# Altium project EXTERN.PrjPcb
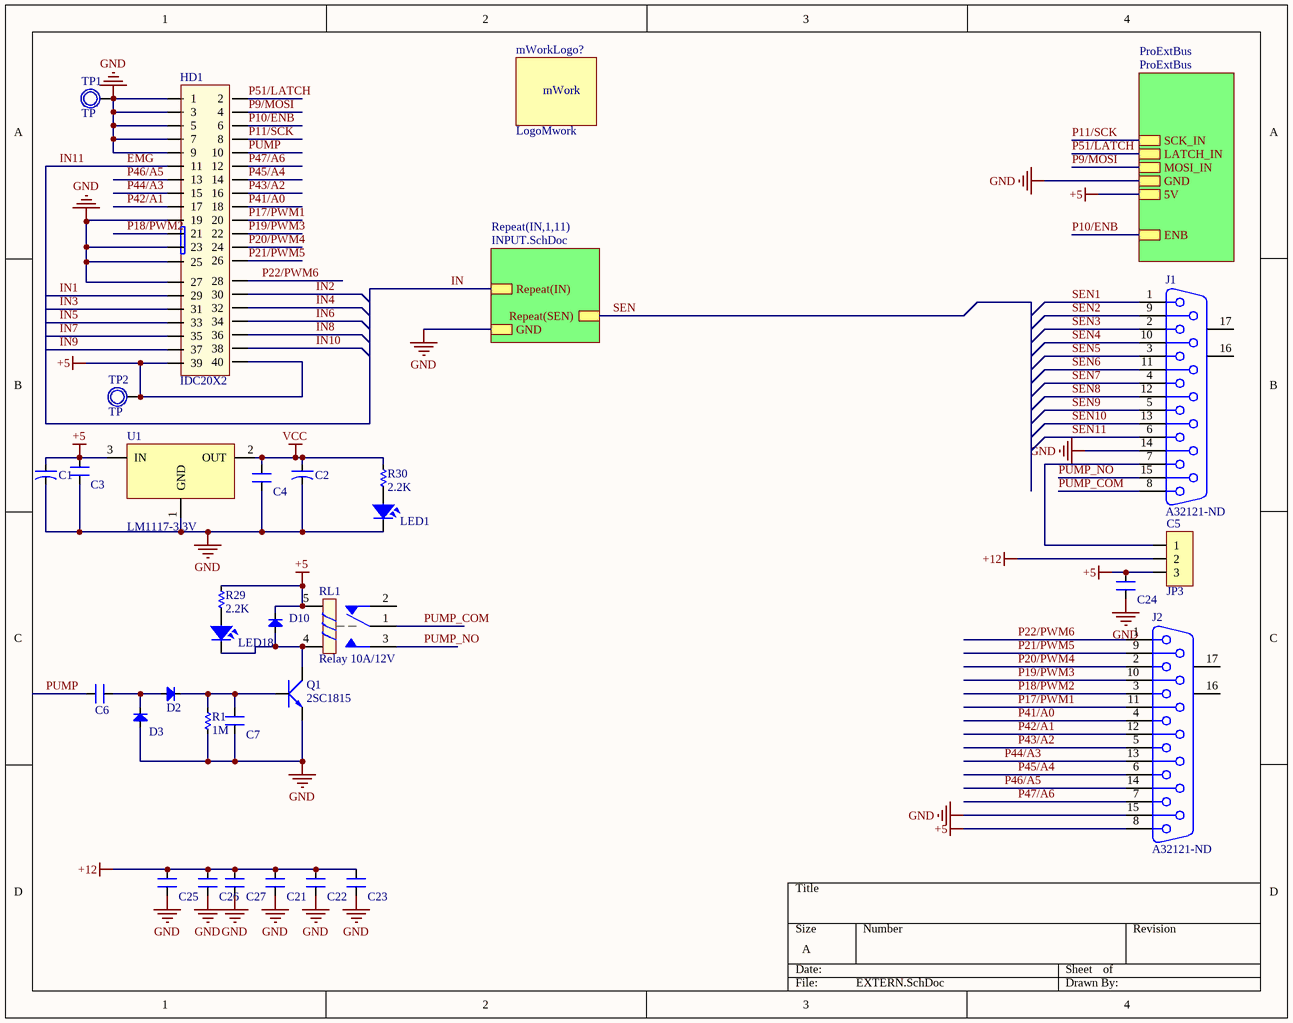
[diagram p0: EXTERN.SchDoc]
3 sheets, 156 parts. Net scope: hierarchical (ports join the sheet entries above them; power ports are global).
Board file: Exter.PcbDoc
Sheets:
  EXTERN.SchDoc
    ProExtBus = ProExtBus.SchDoc
    IN1 = INPUT.SchDoc
    IN2 = INPUT.SchDoc
    IN3 = INPUT.SchDoc
    IN4 = INPUT.SchDoc
    IN5 = INPUT.SchDoc
    IN6 = INPUT.SchDoc
    IN7 = INPUT.SchDoc
    IN8 = INPUT.SchDoc
    IN9 = INPUT.SchDoc
    IN10 = INPUT.SchDoc
    IN11 = INPUT.SchDoc

## Sheet EXTERN.SchDoc
size A

### Parts
(Parts that share a designator on the sheet are numbered #1, #2 ... from top to bottom, then left to right.)
C1  CN-ALU-SMD  [CAP-ALU-SMD-F]  (value not drawn)
C2  CN-ALU-SMD  [CAP-ALU-SMD-F]  (value not drawn)
C3  CN  [CN-SMD-0603_big]  (value not drawn)
C4  CN  [CN-SMD-0603_big]  (value not drawn)
C5  JP3  [JP3-CLOSED]
C6  10nF  [CN-SMD-0805]  (value not drawn)
C7  10nF  [CN-SMD-0805]  (value not drawn)
C21  CN  [CN-SMD-0603_big]  (value not drawn)
C22  CN  [CN-SMD-0603_big]  (value not drawn)
C23  CN  [CN-SMD-0603_big]  (value not drawn)
C24  CN  [CN-SMD-0603_big]  (value not drawn)
C25  CN  [CN-SMD-0603_big]  (value not drawn)
C26  CN  [CN-SMD-0603_big]  (value not drawn)
C27  CN  [CN-SMD-0603_big]  (value not drawn)
D2#1  Diode  [DIO-SMD-106-HayDung]  (value not drawn)
D3  Diode  [DIO-SMD-106-HayDung]  (value not drawn)
D10  1N4148  [DIO-SMD-106-HayDung]  (value not drawn)
HD1  IDC20X2  [IDC40]
J1  A32121-ND  [DB15]
J2  A32121-ND  [DB15]
LED1  LED  [LED-0805-Blue]  (value not drawn)
LED18  LED  [LED-0805-Blue]  (value not drawn)
mWorkLogo?  LogoMwork  [LogoMwork30*12]
Q1  2SC1815  [TO92-123]
R1  1M  [RES-SMD-0805]
R29  2.2K  [RES-SMD-0805]
R30  2.2K  [RES-SMD-0805]
RL1  Relay 10A/12V  [RELAY 5]
TP1  TP  [TP1]
TP2  TP  [TP1]
U1  LM1117-3.3V  [SOT223]

### Sub-sheets
ProExtBus = ProExtBus: SCK_IN, LATCH_IN, MOSI_IN, GND, 5V, ENB
Repeat(IN,1,11) = INPUT.SchDoc: Repeat(IN), GND, Repeat(SEN)

### Nets
+5: C1.1 C2.1 C3.2 C4.2 C5.3 C24.2 D10.2(K) HD1.39 HD1.40 J2.8 R29.1 R30.1 RL1.5 TP2.1 U1.2(OUT) U1.3(IN) ; sheet ProExtBus/5V  [also labelled VCC]
+12: C5.2 C21.2 C22.2 C23.2 C25.2 C26.2 C27.2
GND: C1.2 C2.2 C3.1 C4.1 C7.1 C21.1 C22.1 C23.1 C24.1 C25.1 C26.1 C27.1 D3.1(A) HD1.1 HD1.3 HD1.5 HD1.7 HD1.9 HD1.19 HD1.23 HD1.25 HD1.27 J1.14 J2.15 LED1.2 Q1.1(E) R1.2 TP1.1 U1.1(GND) ; sheet ProExtBus/GND, sheet Repeat(IN,1,11)/GND
EMG: HD1.11  [also labelled IN11]
IN: sheet Repeat(IN,1,11)/Repeat(IN)
IN1: HD1.29
IN2: HD1.30
IN3: HD1.31
IN4: HD1.32
IN5: HD1.33
IN6: HD1.34
IN7: HD1.35
IN8: HD1.36
IN9: HD1.37
IN10: HD1.38
P9/MOSI: HD1.4 ; sheet ProExtBus/MOSI_IN
P10/ENB: HD1.6 ; sheet ProExtBus/ENB
P11/SCK: HD1.8 ; sheet ProExtBus/SCK_IN
P17/PWM1: HD1.20 J2.11
P18/PWM2: HD1.21 J2.3
P19/PWM3: HD1.22 J2.10
P20/PWM4: HD1.24 J2.2
P21/PWM5: HD1.26 J2.9
P22/PWM6: HD1.28 J2.1
P41/A0: HD1.18 J2.4
P42/A1: HD1.17 J2.12
P43/A2: HD1.16 J2.5
P44/A3: HD1.15 J2.13
P45/A4: HD1.14 J2.6
P46/A5: HD1.13 J2.14
P47/A6: HD1.12 J2.7
P51/LATCH: HD1.2 ; sheet ProExtBus/LATCH_IN
PUMP: C6.1 HD1.10
PUMP_COM: J1.8 RL1.1
PUMP_NO: J1.15 RL1.3
SEN: sheet Repeat(IN,1,11)/Repeat(SEN)
SEN1: J1.1
SEN2: J1.9
SEN3: J1.2
SEN4: J1.10
SEN5: J1.3
SEN6: J1.11
SEN7: J1.4
SEN8: J1.12
SEN9: J1.5
SEN10: J1.13
SEN11: J1.6
NetC5_1: C5.1 J1.7
NetC6_2: C6.2 D2#1.1(A) D3.2(K)
NetC7_2: C7.2 D2#1.2(K) Q1.3(B) R1.1
NetD10_1: D10.1(A) LED18.2 Q1.2(C) RL1.4
NetLED1_1: LED1.1 R30.2
NetLED18_1: LED18.1 R29.2

Not connected (* = marked no-connect by the designer): J1 16(MH1) 17(MH2); J2 16(MH1) 17(MH2); RL1 2

### Notes on the sheet
- (in symbol LogoMwork) mWork

### Library data of the parts
C1 C2 = CN-ALU-SMD: Polarized Capacitor (Axial); Published: 8-Jun-2000; LatestRevisionDate: 17-Jul-2002; LatestRevisionNote: Re-released for DXP Platform.; PackageReference: POLAR0.8; Publisher: Altium Limited
C3 C4 C6 C7 C21-C27 = CN: Value: 33pF
C5 = JP3: WR-PHD 2.54 mm Angled Socket Header; Manufacturer: W¨¹rth Elektronik eiSos GmbH; partNo: 613003143121; ComponentLink1 Description: Manufacturer; ComponentLink2 Description: Datasheet; NoPins: 03; Created Date: 29 March 2013; ComponentLink1URL: http://www.we-online.com; ComponentLink2URL: http://katalog.we-online.de/em/datasheet/6130xx143121.pdf; Created by: Karrer Zheng
D2#1 D3 D10 = Diode: Default Diode; Code - JEDEC: DO-214-AB; Value: 1N5007; Published: 8-Jun-2000; Revision: July-2002: Re-released for DXP Platform.; Publisher: Altium Limited; ComponentLink1Description: ES1J - STMBL; ComponentLink1URL: https://banlinhkien.vn/goods-8089-es1j-do214-diode-1a-600v-sma-es1j-.html
HD1 = IDC20X2: IDC 13x2; Value: Header 5x2
J1 J2 = DB15: Receptacle Assembly, 15 Position, Right Angle; PackageDocument: O; Positions: 15; Published: 15-Jun-2001; LatestRevisionDate: 17-Jul-2002; LatestRevisionNote: Re-released for DXP Platform.; DatasheetDocument: 1-Sep-99; PackageReference: 788757; Publisher: Altium Limited; Orientation: Right Angle; Gender: Receptacle
LED1 LED18 = LED SMD: Value: LED 3 - 5 ly 2 Colour
Q1 = 2SC1815: NPN 600mW, ECB; Value: C1815
R1 R29 R30 = R
RL1 = Relay 5: Relay SPDT,10A - 12VDC 5 Pin; Value: Relay SPDT, 10A, 12V
TP1 TP2 = TP1: Test Point; Value: Test Point
U1 = LM1117: 800mA Low-Dropout Linear Regulator; Creator: Nguyen Ba Bien; Website: http://group3i.net

## Sheet ProExtBus.SchDoc
size A
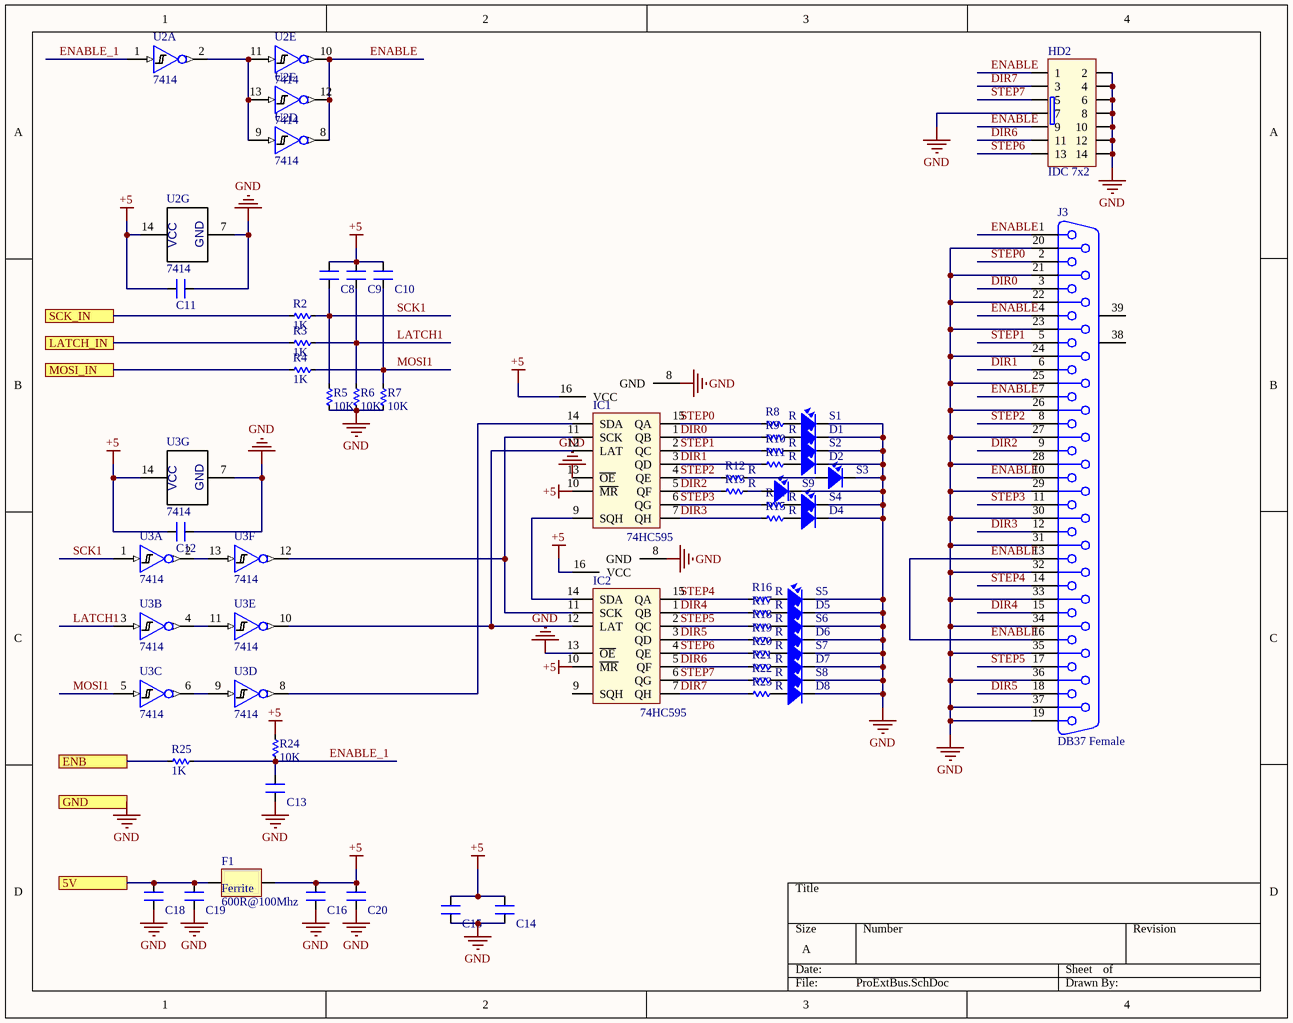
[diagram p1: ProExtBus.SchDoc]

### Parts
(Parts that share a designator on the sheet are numbered #1, #2 ... from top to bottom, then left to right.)
C8  CN  [CN-SMD-0603_big]  (value not drawn)
C9  CN  [CN-SMD-0603_big]  (value not drawn)
C10  CN  [CN-SMD-0603_big]  (value not drawn)
C11  CN  [CN-SMD-0603_big]  (value not drawn)
C12  CN  [CN-SMD-0603_big]  (value not drawn)
C13  CN  [CN-SMD-0603_big]  (value not drawn)
C14  CN  [CN-SMD-0603_big]  (value not drawn)
C15  CN  [CN-SMD-0603_big]  (value not drawn)
C16  CN  [CN-SMD-0603_big]  (value not drawn)
C18  CN  [CN-SMD-0603_big]  (value not drawn)
C19  CN  [CN-SMD-0603_big]  (value not drawn)
C20  CN  [CN-SMD-0603_big]  (value not drawn)
D1  LED  [LED-0805-Blue]  (value not drawn)
D2#2  LED  [LED-0805-Blue]  (value not drawn)
D4  LED  [LED-0805-Blue]  (value not drawn)
D5  LED  [LED-0805-Blue]  (value not drawn)
D6  LED  [LED-0805-Blue]  (value not drawn)
D7  LED  [LED-0805-Blue]  (value not drawn)
D8  LED  [LED-0805-Blue]  (value not drawn)
F1  600R@100Mhz  [Capacitor_805]
HD2  IDC 7x2  [IDC14]
IC1  74HC595  [SO16]
IC2  74HC595  [SO16]
J3  DB37 Female  [DB37]
R2  1K  [RES-SMD-0603_BIG]
R3  1K  [RES-SMD-0603_BIG]
R4  1K  [RES-SMD-0603_BIG]
R5  10K  [RES-SMD-0603_BIG]
R6  10K  [RES-SMD-0603_BIG]
R7  10K  [RES-SMD-0603_BIG]
R8  R  [RES-SMD-0603_BIG]
R9  R  [RES-SMD-0603_BIG]
R10  R  [RES-SMD-0603_BIG]
R11  R  [RES-SMD-0603_BIG]
R12  R  [RES-SMD-0603_BIG]
R13  R  [RES-SMD-0603_BIG]
R14  R  [RES-SMD-0603_BIG]
R15  R  [RES-SMD-0603_BIG]
R16  R  [RES-SMD-0603_BIG]
R17  R  [RES-SMD-0603_BIG]
R18  R  [RES-SMD-0603_BIG]
R19  R  [RES-SMD-0603_BIG]
R20  R  [RES-SMD-0603_BIG]
R21  R  [RES-SMD-0603_BIG]
R22  R  [RES-SMD-0603_BIG]
R23  R  [RES-SMD-0603_BIG]
R24  10K  [RES-SMD-0603_BIG]
R25  1K  [RES-SMD-0603_BIG]
S1  LED  [LED-0805-Blue]  (value not drawn)
S2  LED  [LED-0805-Blue]  (value not drawn)
S3  LED  [LED-0805-Blue]  (value not drawn)
S4  LED  [LED-0805-Blue]  (value not drawn)
S5  LED  [LED-0805-Blue]  (value not drawn)
S6  LED  [LED-0805-Blue]  (value not drawn)
S7  LED  [LED-0805-Blue]  (value not drawn)
S8  LED  [LED-0805-Blue]  (value not drawn)
S9  LED  [LED-0805-Blue]  (value not drawn)
U2  7414  [SO14]  (parts A,D,E,F,G of 7)
U3  7414  [SO14]  (parts A,B,C,D,E,F,G of 7)

### Ports
5V, ENB, GND, LATCH_IN, MOSI_IN, SCK_IN

### Nets
+5: C8.2 C9.2 C10.2 C11.1 C12.1 C14.2 C15.2 C16.2 C18.2 C19.2 C20.2 F1.1 F1.2 IC1.10(~{MR}) IC1.16(VCC) IC2.10(~{MR}) IC2.16(VCC) R24.1 U2.14(VCC) U3.14(VCC) ; port 5V  [also labelled VCC]
GND: C11.2 C12.2 C13.1 C14.1 C15.1 C16.1 C18.1 C19.1 C20.1 D1.2 D2#2.2 D4.2 D5.2 D6.2 D7.2 D8.2 HD2.2 HD2.4 HD2.6 HD2.7 HD2.8 HD2.10 HD2.12 HD2.14 IC1.8(GND) IC1.13(~{OE}) IC2.8(GND) IC2.13(~{OE}) J3.19 J3.20 J3.21 J3.22 J3.23 J3.24 J3.25 J3.26 J3.27 J3.28 J3.29 J3.30 J3.31 J3.32 J3.33 J3.34 J3.35 J3.36 J3.37 R5.2 R6.2 R7.2 S1.2 S2.2 S3.2 S4.2 S5.2 S6.2 S7.2 S8.2 S9.2 U2.7(GND) U3.7(GND) ; port GND
DIR0: IC1.1(QB) J3.3 R9.1
DIR1: IC1.3(QD) J3.6 R11.1
DIR2: IC1.5(QF) J3.9 R13.1
DIR3: IC1.7(QH) J3.12 R15.1
DIR4: IC2.1(QB) J3.15 R17.1
DIR5: IC2.3(QD) J3.18 R19.1
DIR6: HD2.11 IC2.5(QF) R21.1
DIR7: HD2.3 IC2.7(QH) R23.1
ENABLE: HD2.1 HD2.9 J3.1 J3.4 J3.7 J3.10 J3.13 J3.16 U2.8(Y) U2.10(Y) U2.12(Y)
ENABLE_1: C13.2 R24.2 R25.1 U2.1(A)
LATCH1: C9.1 R3.1 R6.1 U3.3(A)
MOSI1: C10.1 R4.1 R7.1 U3.5(A)
P9/MOSI: R4.2 ; port MOSI_IN
P10/ENB: R25.2 ; port ENB
P11/SCK: R2.2 ; port SCK_IN
P51/LATCH: R3.2 ; port LATCH_IN
SCK1: C8.1 R2.1 R5.1 U3.1(A)
STEP0: IC1.15(QA) J3.2 R8.1
STEP1: IC1.2(QC) J3.5 R10.1
STEP2: IC1.4(QE) J3.8 R12.1
STEP3: IC1.6(QG) J3.11 R14.1
STEP4: IC2.15(QA) J3.14 R16.1
STEP5: IC2.2(QC) J3.17 R18.1
STEP6: HD2.13 IC2.4(QE) R20.1
STEP7: HD2.5 IC2.6(QG) R22.1
NetD1_1: D1.1 R9.2
NetD2#2_1: D2#2.1 R11.2
NetD4_1: D4.1 R15.2
NetD5_1: D5.1 R17.2
NetD6_1: D6.1 R19.2
NetD7_1: D7.1 R21.2
NetD8_1: D8.1 R23.2
NetIC1_9: IC1.9(SQH) IC2.14(SDA)
NetIC1_11: IC1.11(SCK) IC2.11(SCK) U3.12(Y)
NetIC1_12: IC1.12(LAT) IC2.12(LAT) U3.10(Y)
NetIC1_14: IC1.14(SDA) U3.8(Y)
NetR8_2: R8.2 S1.1
NetR10_2: R10.2 S2.1
NetR12_2: R12.2 S3.1
NetR13_2: R13.2 S9.1
NetR14_2: R14.2 S4.1
NetR16_2: R16.2 S5.1
NetR18_2: R18.2 S6.1
NetR20_2: R20.2 S7.1
NetR22_2: R22.2 S8.1
NetU2_2: U2.2(Y) U2.9(A) U2.11(A) U2.13(A)
NetU3_2: U3.2(Y) U3.13(A)
NetU3_4: U3.4(Y) U3.11(A)
NetU3_6: U3.6(Y) U3.9(A)

Not connected (* = marked no-connect by the designer): IC2 9(SQH); J3 38(MH1) 39(MH2)

### Library data of the parts
C8-C16 C18-C20 = CN: Value: 33pF
D1 D2#2 D4-D8 S1-S9 = LED SMD: Value: LED 3 - 5 ly 2 Colour
F1 = Ferrite
HD2 = IDC 7X2: Value: Header 5x2
IC1 IC2 = 74595: 8 Bit Serial input - Parallel Output; Value: 74HC595
R2-R7 R24 R25 = R
U2 U3 = 7414: IC, M74HC04M, Hex Inverter, SO-14; Text Field1: ST; Text Field2: M74HC04M1R; Text Field3: Mouser; Text Field4: 511-M74HC04M; Text Field6: .22; Text Field5: SO-14; NI?: *; O?: *; Section:: *

## Sheet INPUT.SchDoc
size A
Used 11 times, as channels IN1, IN2, IN3, IN4, IN5, IN6, IN7, IN8, IN9, IN10, IN11. Parts and nets are listed once, with the designators drawn on the sheet.
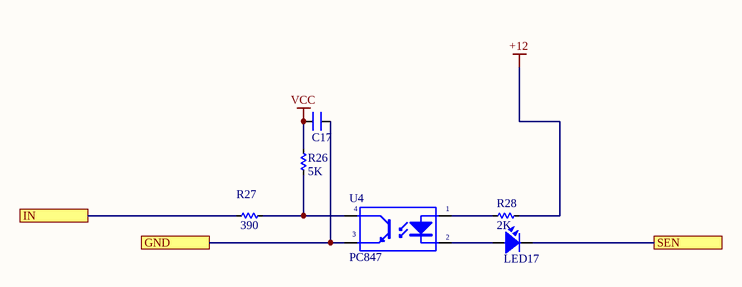
[diagram p2: INPUT.SchDoc]

### Parts
C17  CN  [CN-SMD-0603_big]  (value not drawn)
LED17  LED  [LED-0805-Green]  (value not drawn)
R26  5K  [RES-SMD-0603_BIG]
R27  390  [RES-SMD-0603_BIG]
R28  2K  [RES-SMD-0603_BIG]
U4  PC847  [DIP4]

### Ports
GND, IN, SEN

### Nets
+12: R28.1
VCC: C17.1 R26.1
GND: C17.2 U4.3(E) ; port GND
IN: R27.1 ; port IN
SEN: LED17.2 ; port SEN
NetLED17_1: LED17.1 U4.2(K)
NetR26_2: R26.2 R27.2 U4.4(C)
NetR28_2: R28.2 U4.1(A)

### Channels
IN1: designators end in _IN1; ports GND=GND IN=IN1 SEN=SEN1
IN2: designators end in _IN2; ports GND=GND IN=IN2 SEN=SEN2
IN3: designators end in _IN3; ports GND=GND IN=IN3 SEN=SEN3
IN4: designators end in _IN4; ports GND=GND IN=IN4 SEN=SEN4
IN5: designators end in _IN5; ports GND=GND IN=IN5 SEN=SEN5
IN6: designators end in _IN6; ports GND=GND IN=IN6 SEN=SEN6
IN7: designators end in _IN7; ports GND=GND IN=IN7 SEN=SEN7
IN8: designators end in _IN8; ports GND=GND IN=IN8 SEN=SEN8
IN9: designators end in _IN9; ports GND=GND IN=IN9 SEN=SEN9
IN10: designators end in _IN10; ports GND=GND IN=IN10 SEN=SEN10
IN11: designators end in _IN11; ports GND=GND IN=EMG SEN=SEN11

### Library data of the parts
C17 = CN: Value: 33pF
LED17 = LED SMD: Value: LED 3 - 5 ly 2 Colour
R26-R28 = R
U4 = PC817: Single Opto; Value: PC817

## Nets that join several sheets
+5: EXTERN (16 pins), ProExtBus (20 pins), IN1 (C17_IN1.1 R26_IN1.1), IN2 (C17_IN2.1 R26_IN2.1), IN3 (C17_IN3.1 R26_IN3.1), IN4 (C17_IN4.1 R26_IN4.1), IN5 (C17_IN5.1 R26_IN5.1), IN6 (C17_IN6.1 R26_IN6.1), IN7 (C17_IN7.1 R26_IN7.1), IN8 (C17_IN8.1 R26_IN8.1), IN9 (C17_IN9.1 R26_IN9.1), IN10 (C17_IN10.1 R26_IN10.1), IN11 (C17_IN11.1 R26_IN11.1)
+12: EXTERN (7 pins), IN1 (R28_IN1.1), IN2 (R28_IN2.1), IN3 (R28_IN3.1), IN4 (R28_IN4.1), IN5 (R28_IN5.1), IN6 (R28_IN6.1), IN7 (R28_IN7.1), IN8 (R28_IN8.1), IN9 (R28_IN9.1), IN10 (R28_IN10.1), IN11 (R28_IN11.1)
GND: EXTERN (29 pins), ProExtBus (61 pins), IN1 (C17_IN1.2 U4_IN1.3), IN2 (C17_IN2.2 U4_IN2.3), IN3 (C17_IN3.2 U4_IN3.3), IN4 (C17_IN4.2 U4_IN4.3), IN5 (C17_IN5.2 U4_IN5.3), IN6 (C17_IN6.2 U4_IN6.3), IN7 (C17_IN7.2 U4_IN7.3), IN8 (C17_IN8.2 U4_IN8.3), IN9 (C17_IN9.2 U4_IN9.3), IN10 (C17_IN10.2 U4_IN10.3), IN11 (C17_IN11.2 U4_IN11.3)
EMG: EXTERN (HD1.11), IN11 (R27_IN11.1)
IN1: EXTERN (HD1.29), IN1 (R27_IN1.1)
IN2: EXTERN (HD1.30), IN2 (R27_IN2.1)
IN3: EXTERN (HD1.31), IN3 (R27_IN3.1)
IN4: EXTERN (HD1.32), IN4 (R27_IN4.1)
IN5: EXTERN (HD1.33), IN5 (R27_IN5.1)
IN6: EXTERN (HD1.34), IN6 (R27_IN6.1)
IN7: EXTERN (HD1.35), IN7 (R27_IN7.1)
IN8: EXTERN (HD1.36), IN8 (R27_IN8.1)
IN9: EXTERN (HD1.37), IN9 (R27_IN9.1)
IN10: EXTERN (HD1.38), IN10 (R27_IN10.1)
P9/MOSI: EXTERN (HD1.4), ProExtBus (R4.2)
P10/ENB: EXTERN (HD1.6), ProExtBus (R25.2)
P11/SCK: EXTERN (HD1.8), ProExtBus (R2.2)
P51/LATCH: EXTERN (HD1.2), ProExtBus (R3.2)
SEN1: EXTERN (J1.1), IN1 (LED17_IN1.2)
SEN2: EXTERN (J1.9), IN2 (LED17_IN2.2)
SEN3: EXTERN (J1.2), IN3 (LED17_IN3.2)
SEN4: EXTERN (J1.10), IN4 (LED17_IN4.2)
SEN5: EXTERN (J1.3), IN5 (LED17_IN5.2)
SEN6: EXTERN (J1.11), IN6 (LED17_IN6.2)
SEN7: EXTERN (J1.4), IN7 (LED17_IN7.2)
SEN8: EXTERN (J1.12), IN8 (LED17_IN8.2)
SEN9: EXTERN (J1.5), IN9 (LED17_IN9.2)
SEN10: EXTERN (J1.13), IN10 (LED17_IN10.2)
SEN11: EXTERN (J1.6), IN11 (LED17_IN11.2)